# EAGLE design untitled (EAGLE 6.1)
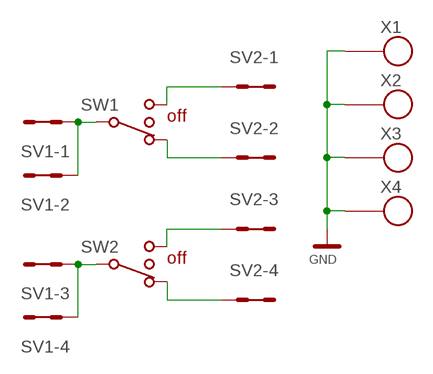
[diagram p0: schematic, sheet 1]

## Parts
SV1  MA04-2  [MA04-2]
SV2  MA04-2  [MA04-2]
SW1  PREPINAC_POSUVNY_SL19-121  [PREPINAC-POSUVNÝ]
SW2  PREPINAC_POSUVNY_SL19-121  [PREPINAC-POSUVNÝ]
X1  SROUB3M  [SROUB3M]
X2  SROUB3M  [SROUB3M]
X3  SROUB3M  [SROUB3M]
X4  SROUB3M  [SROUB3M]

## Nets
GND: X1.P$1 X2.P$1 X3.P$1 X4.P$1
N$1: SV1.1 SV1.2 SV1.3 SV1.4 SW1.2
N$2: SV1.5 SV1.6 SV1.7 SV1.8 SW2.2
N$3: SV2.1 SV2.2 SW1.3
N$4: SV2.5 SV2.6 SW2.3
N$5: SV2.7 SV2.8 SW2.1
N$6: SV2.3 SV2.4 SW1.1

## Library data of the parts
SV1 SV2 = moje_hrebinky:MA04-2: PIN HEADER; OC_FARNELL: unknown; OC_NEWARK: unknown
SW1 SW2 = moje:PREPINAC_POSUVNY_SL19-121
X1-X4 = moje:SROUB3M

## Board
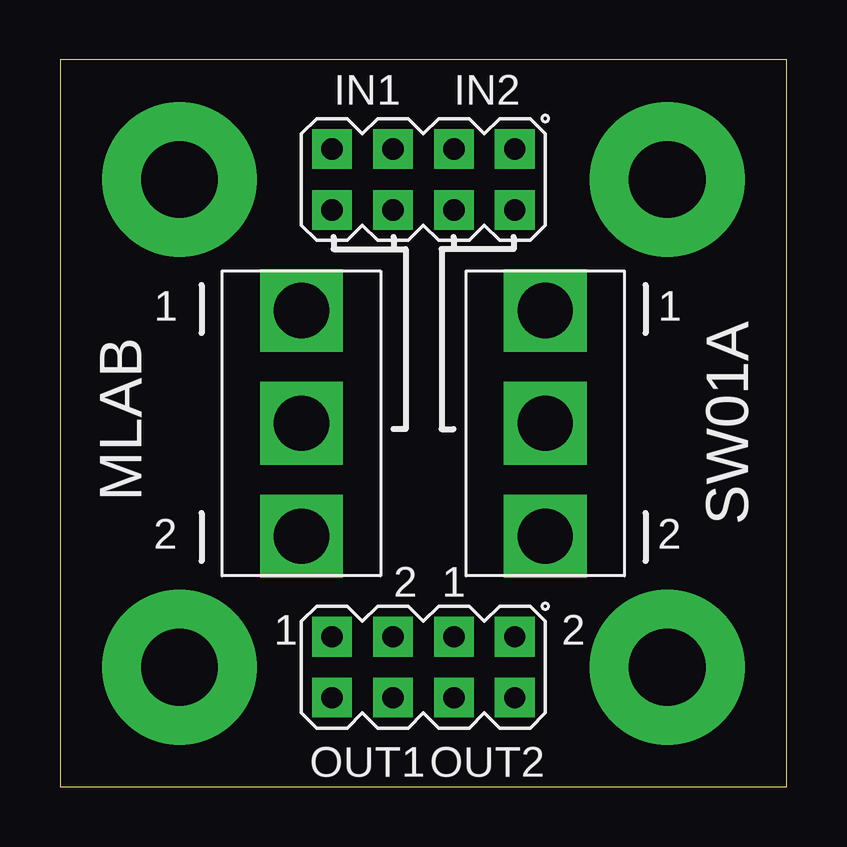
[diagram p1: board, top side]
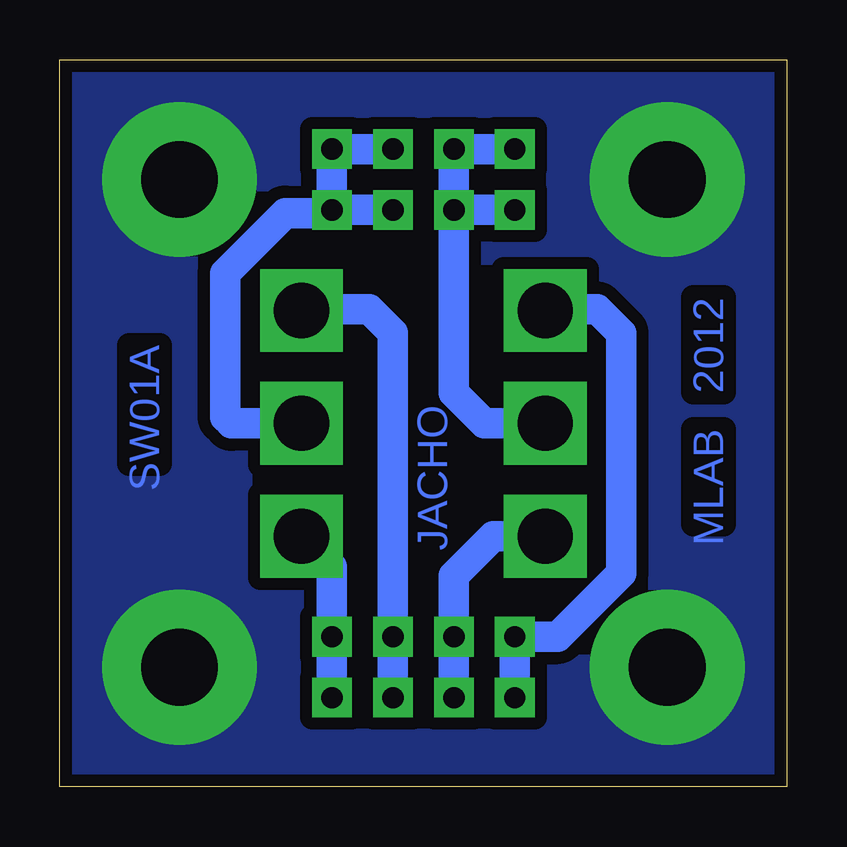
[diagram p2: board, bottom side, seen from below]

Size 30.28 x 30.28 mm. Coordinates in mm from the lower left corner, seen from the top.
Outline: 0,0 30.28,0 30.28,30.28 0,30.28 0,0
Copper layers (1*16): Top 0.035mm / dielectric 1mm / Bottom 0.035mm
Design rules: minimum track width 12mil, minimum drill 24mil, track to track 20mil, track to pad 20mil, pad to pad 20mil, via to via 20mil, smd to smd 8mil, copper to edge 20mil, drill to drill 70mil, minimum pad ring 10mil, minimum via ring 8mil, stop-mask expansion 5mil, vias tented up to drill 0mil, thermal gap 0mil

### Footprints (pad centres in the part's own frame; a part is rotated, then mirrored left to right if it is on the bottom)
MA04-2 = drill 0.889 pad 1.651 square: 1 -3.81,-1.27; 2 -3.81,1.27; 3 -1.27,-1.27; 4 -1.27,1.27; 5 1.27,-1.27; 6 1.27,1.27; 7 3.81,-1.27; 8 3.81,1.27
PREPINAC-POSUVNÝ = drill 2.3 pad 3.4 square: 1 0,4.7; 2 0,0; 3 0,-4.7
SROUB3M = drill 3.2 pad 6.452: P$1 0,0

### Placement (x,y rotation side)
SV1  15.14,25.3 180 top
SV2  15.14,4.98 180 top
SW1  20.22,15.14 0 top
SW2  10.06,15.14 0 top
X1  4.98,4.98 0 top
X2  4.98,25.3 0 top
X3  25.3,25.3 0 top
X4  25.3,4.98 0 top

### Tracks (layer width: path | path; a pad name or v marks a point on that pad's centre or on a via)
GND
  pour Bottom: 0.4,30.4 -0.1,30.4 -0.1,-0.1 30.4,-0.1 30.4,30.4
N$1
  Bottom 0.61: 23.14,15.14 23.4,15.4 | 19.08,23.9 SV1.2
  Bottom 1.27: SV1.4 SV1.2 SV1.1 SV1.3 | SW1.2 23.14,15.14 | 23.4,15.4 23.4,21.4 20.9,23.9 19.08,23.9
N$2
  Bottom 1.27: SW2.2 12.6,15.14 13.87,16.41 SV1.6 | SV1.6 SV1.5 SV1.7 | SV1.8 SV1.6
N$3
  Bottom 1.27: SV2.2 SV2.1 18.95,9.17 SW1.3
N$4
  Bottom 1.27: SV2.6 SV2.5 13.87,8.79 12.22,10.44 SW2.3
N$5
  Bottom 0.61: 10,19.9 SW2.1
  Bottom 1.27: SV2.8 SV2.7 9.55,6.25 6.9,8.9 6.9,18.9 7.9,19.9 10,19.9
N$6
  Bottom 0.61: 20.4,19.9 20.28,19.9 SW1.1
  Bottom 1.27: SV2.4 SV2.3 16.41,18.91 17.4,19.9 20.28,19.9

### Text on the board
Bottom: 2012 | SW01A | JACHO | MLAB
tPlace: IN1 | IN2 | 1 | 1 | SW01A | MLAB | 2 | 2 | 2 | 1 | 1 | 2 | OUT1 | OUT2